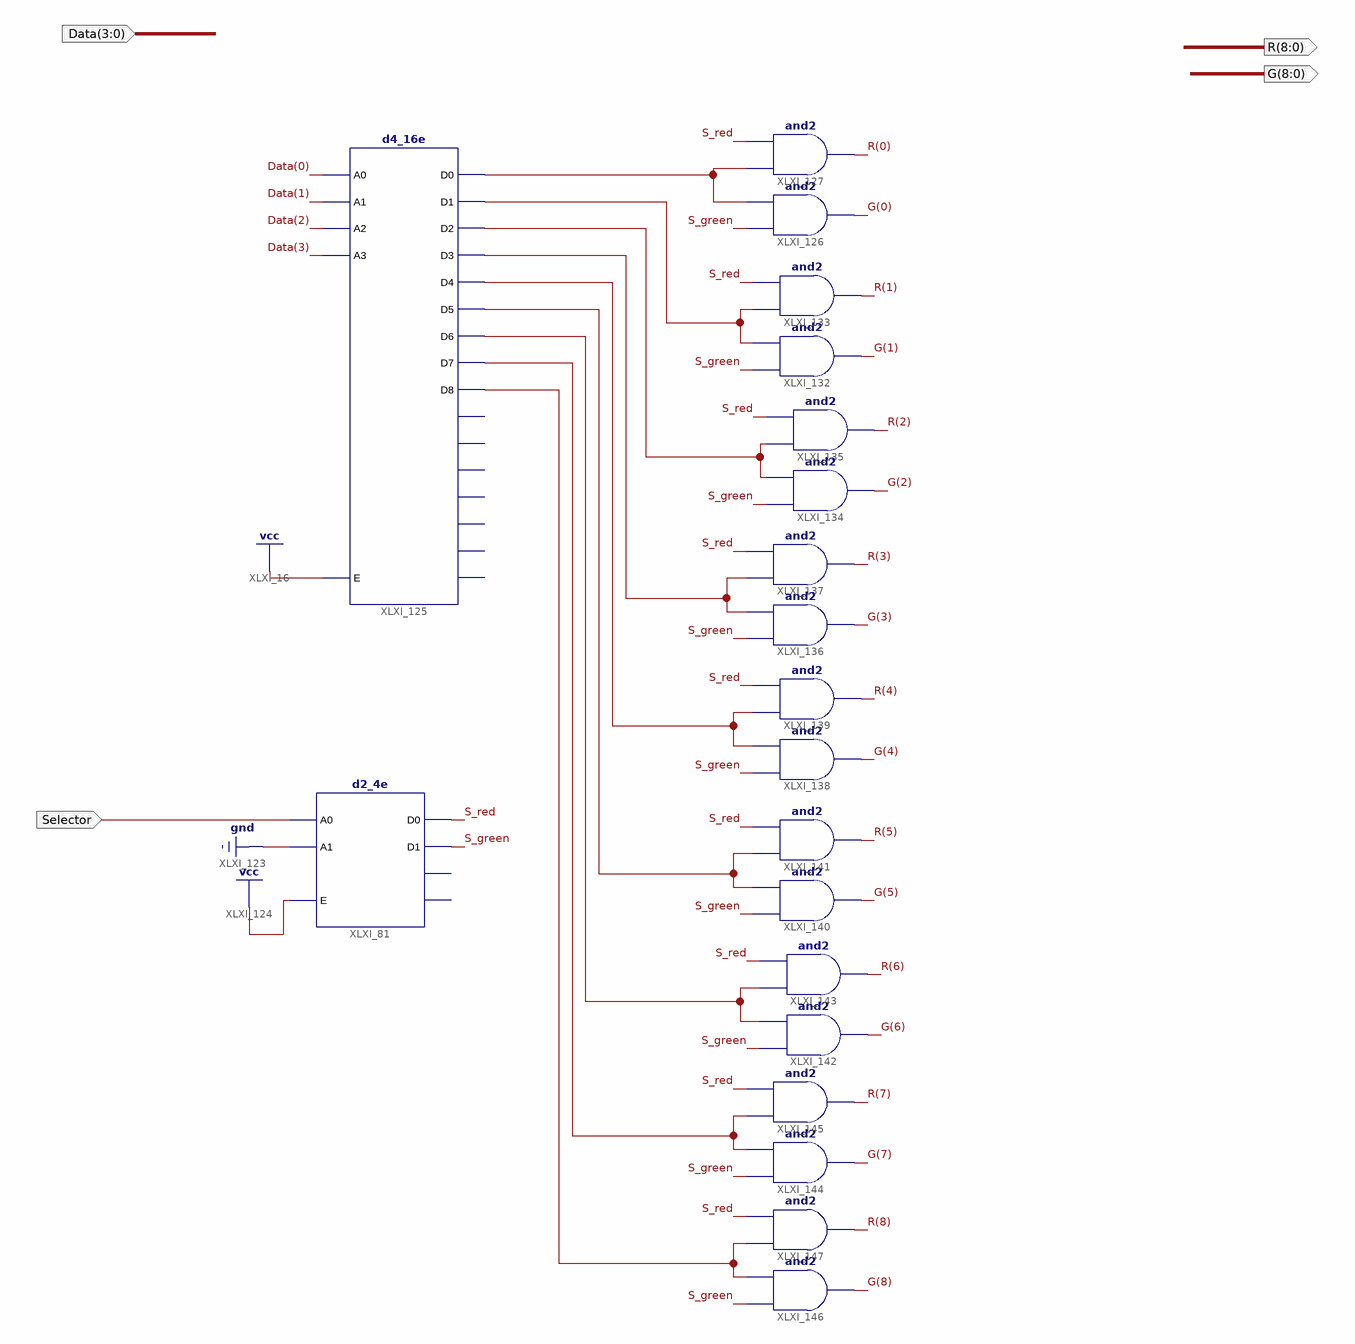
[diagram p0: schematic sheet 1]
// Xilinx ISE schematic dataToLed.sch (spartan6) as structural Verilog: 20 symbols, 4 ports
module dataToLed (
  input  Selector,
  input  [3:0] Data,
  output [8:0] R,
  output [8:0] G
);

  wire S_green, S_red, XLXN_289, XLXN_324, XLXN_327, XLXN_330, XLXN_333, XLXN_336, XLXN_339, XLXN_342,
       XLXN_345;

  d2_4e XLXI_81 (.A0(Selector), .A1(1'b0), .E(1'b1), .D0(S_red), .D1(S_green));  // open: D2, D3
  d4_16e XLXI_125 (
    .A0(Data[0]), .A1(Data[1]), .A2(Data[2]), .A3(Data[3]), .E(1'b1), .D0(XLXN_289), .D1(XLXN_324),
    .D2(XLXN_327), .D3(XLXN_330), .D4(XLXN_333), .D5(XLXN_336), .D6(XLXN_339), .D7(XLXN_342), .D8(XLXN_345));  // open: D10, D11, D12, D13, D14, D15, D9
  and XLXI_126 (G[0], S_green, XLXN_289);
  and XLXI_127 (R[0], XLXN_289, S_red);
  and XLXI_132 (G[1], S_green, XLXN_324);
  and XLXI_133 (R[1], XLXN_324, S_red);
  and XLXI_134 (G[2], S_green, XLXN_327);
  and XLXI_135 (R[2], XLXN_327, S_red);
  and XLXI_136 (G[3], S_green, XLXN_330);
  and XLXI_137 (R[3], XLXN_330, S_red);
  and XLXI_138 (G[4], S_green, XLXN_333);
  and XLXI_139 (R[4], XLXN_333, S_red);
  and XLXI_140 (G[5], S_green, XLXN_336);
  and XLXI_141 (R[5], XLXN_336, S_red);
  and XLXI_142 (G[6], S_green, XLXN_339);
  and XLXI_143 (R[6], XLXN_339, S_red);
  and XLXI_144 (G[7], S_green, XLXN_342);
  and XLXI_145 (R[7], XLXN_342, S_red);
  and XLXI_146 (G[8], S_green, XLXN_345);
  and XLXI_147 (R[8], XLXN_345, S_red);
endmodule
